# EAGLE design calculator (EAGLE 9.6.2)
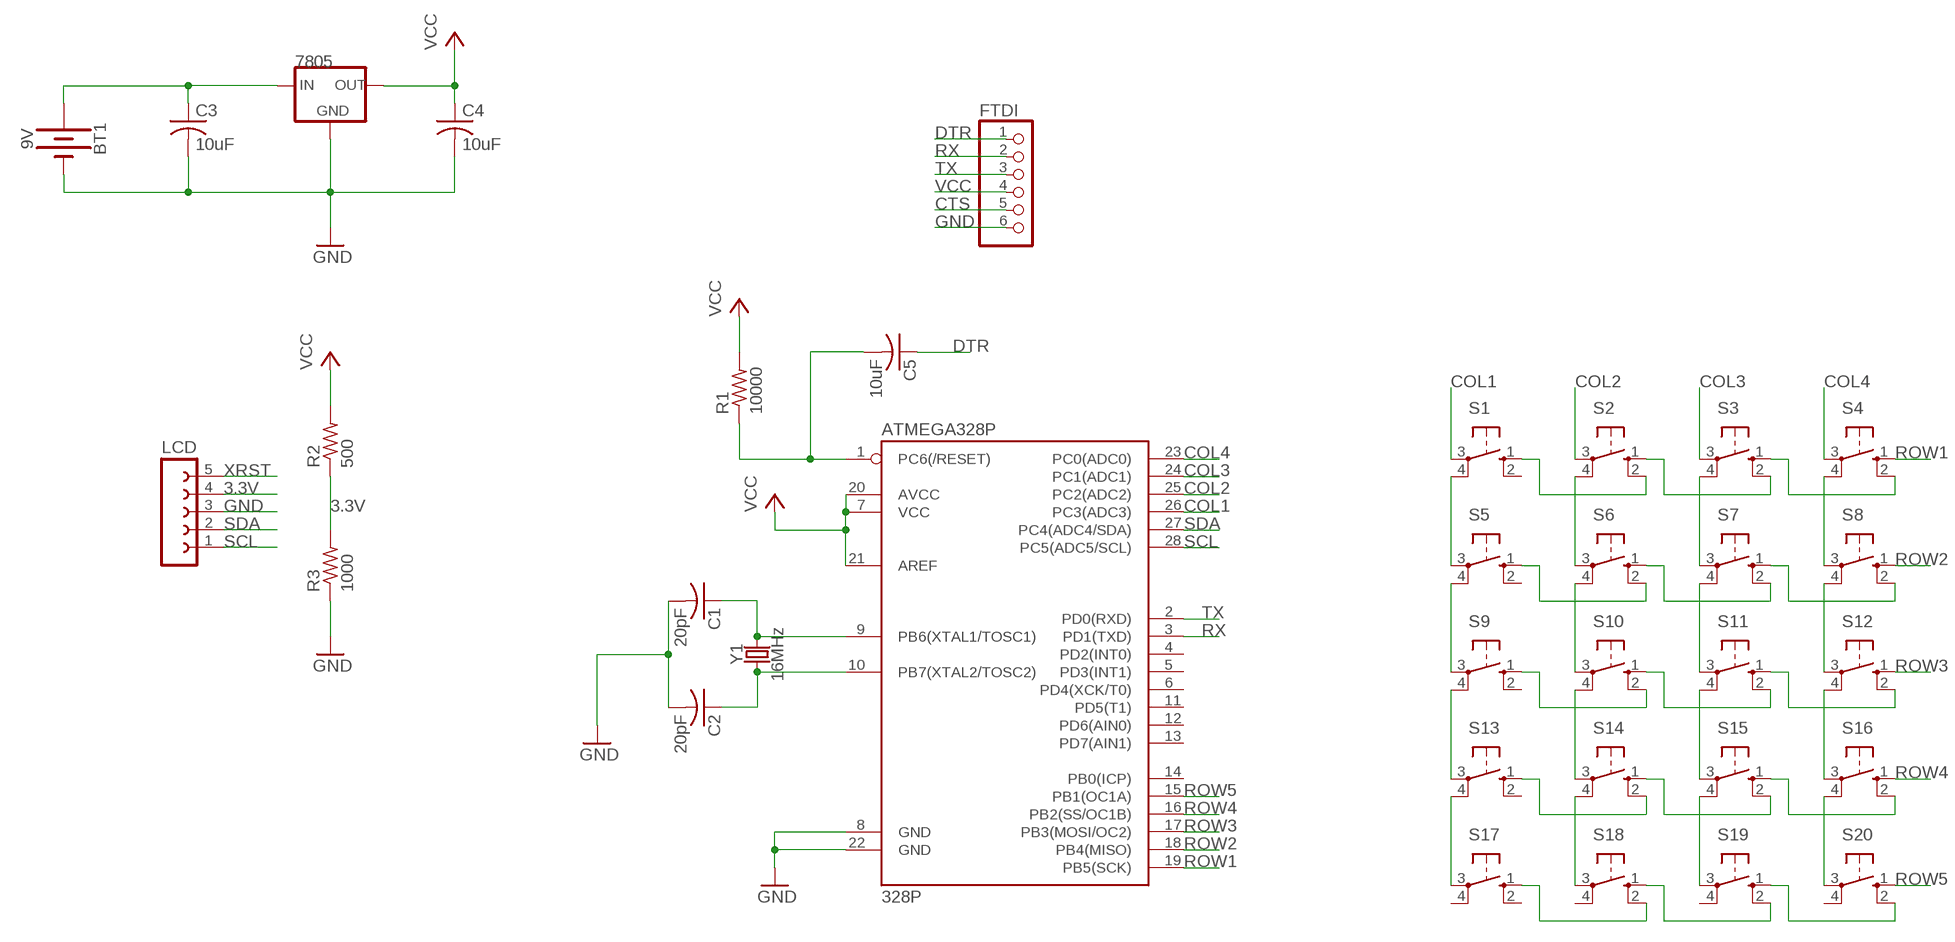
[diagram p0: schematic, sheet 1]

## Parts
7805  78XXS  [78XXS]
ATMEGA328P  328P  ATMEGA328P_PDIP  [DIP28]
BT1  9V  BATTERY-9V  [BATTCON_9V]
C1  20pF  C-US025-024X044  [C025-024X044]
C2  20pF  C-US025-024X044  [C025-024X044]
C3  10uF  C-US025-024X044  [C025-024X044]
C4  10uF  C-US025-024X044  [C025-024X044]
C5  10uF  C-US025-024X044  [C025-024X044]
FTDI  PINHD-1X6  [1X06]
LCD  FE05-1  [FE05-1]
R1  10000  R-US_0204/7  [0204/7]
R2  500  R-US_0204/7  [0204/7]
R3  1000  R-US_0204/7  [0204/7]
S1  10-XX  [B3F-10XX]
S2  10-XX  [B3F-10XX]
S3  10-XX  [B3F-10XX]
S4  10-XX  [B3F-10XX]
S5  10-XX  [B3F-10XX]
S6  10-XX  [B3F-10XX]
S7  10-XX  [B3F-10XX]
S8  10-XX  [B3F-10XX]
S9  10-XX  [B3F-10XX]
S10  10-XX  [B3F-10XX]
S11  10-XX  [B3F-10XX]
S12  10-XX  [B3F-10XX]
S13  10-XX  [B3F-10XX]
S14  10-XX  [B3F-10XX]
S15  10-XX  [B3F-10XX]
S16  10-XX  [B3F-10XX]
S17  10-XX  [B3F-10XX]
S18  10-XX  [B3F-10XX]
S19  10-XX  [B3F-10XX]
S20  10-XX  [B3F-10XX]
Y1  16MHz  CRYSTAL-16MHZPTH-HC49US  [HC49US]

## Nets
3.3V: LCD.4 R2.1 R3.2
COL1: ATMEGA328P.26(PC3(ADC3)) S1.3(P)
COL2: ATMEGA328P.25(PC2(ADC2)) S2.3(P)
COL3: ATMEGA328P.24(PC1(ADC1)) S3.3(P)
COL4: ATMEGA328P.23(PC0(ADC0)) S4.3(P)
CTS: FTDI.5
DTR: C5.1 FTDI.1
GND: 7805.GND ATMEGA328P.8(GND) ATMEGA328P.22(GND) BT1.- C1.2 C2.2 C3.2 C4.2 FTDI.6 LCD.3 R3.1
N$1: 7805.IN BT1.+ C3.1
N$2: ATMEGA328P.10(PB7(XTAL2/TOSC2)) C2.1 Y1.1
N$3: ATMEGA328P.9(PB6(XTAL1/TOSC1)) C1.1 Y1.2
N$4: ATMEGA328P.1(PC6(/RESET)) C5.2 R1.1
N$5: S1.4(P1) S5.3(P)
N$6: S5.4(P1) S9.3(P)
N$7: S9.4(P1) S13.3(P)
N$8: S13.4(P1) S17.3(P)
N$9: S1.1(S) S2.2(S1)
N$10: S2.4(P1) S6.3(P)
N$11: S6.4(P1) S10.3(P)
N$12: S10.4(P1) S14.3(P)
N$13: S14.4(P1) S18.3(P)
N$14: S3.1(S) S4.2(S1)
N$15: S3.4(P1) S7.3(P)
N$16: S7.4(P1) S11.3(P)
N$17: S11.4(P1) S15.3(P)
N$18: S15.4(P1) S19.3(P)
N$19: S9.1(S) S10.2(S1)
N$20: S4.4(P1) S8.3(P)
N$21: S8.4(P1) S12.3(P)
N$22: S12.4(P1) S16.3(P)
N$23: S16.4(P1) S20.3(P)
N$24: S13.1(S) S14.2(S1)
N$25: S17.1(S) S18.2(S1)
N$26: S2.1(S) S3.2(S1)
N$27: S5.1(S) S6.2(S1)
N$28: S6.1(S) S7.2(S1)
N$29: S7.1(S) S8.2(S1)
N$30: S10.1(S) S11.2(S1)
N$31: S11.1(S) S12.2(S1)
N$32: S14.1(S) S15.2(S1)
N$33: S15.1(S) S16.2(S1)
N$34: S18.1(S) S19.2(S1)
N$35: S19.1(S) S20.2(S1)
ROW1: ATMEGA328P.19(PB5(SCK)) S4.1(S)
ROW2: ATMEGA328P.18(PB4(MISO)) S8.1(S)
ROW3: ATMEGA328P.17(PB3(MOSI/OC2)) S12.1(S)
ROW4: ATMEGA328P.16(PB2(SS/OC1B)) S16.1(S)
ROW5: ATMEGA328P.15(PB1(OC1A)) S20.1(S)
RX: ATMEGA328P.3(PD1(TXD)) FTDI.2
SCL: ATMEGA328P.28(PC5(ADC5/SCL)) LCD.1
SDA: ATMEGA328P.27(PC4(ADC4/SDA)) LCD.2
TX: ATMEGA328P.2(PD0(RXD)) FTDI.3
VCC: 7805.OUT ATMEGA328P.7(VCC) ATMEGA328P.20(AVCC) ATMEGA328P.21(AREF) C4.1 FTDI.4 R1.2 R2.2
XRST: LCD.5
Unconnected: ATMEGA328P.4(PD2(INT0)) ATMEGA328P.5(PD3(INT1)) ATMEGA328P.6(PD4(XCK/T0)) ATMEGA328P.11(PD5(T1)) ATMEGA328P.12(PD6(AIN0)) ATMEGA328P.13(PD7(AIN1)) ATMEGA328P.14(PB0(ICP)) S1.2(S1) S5.2(S1) S9.2(S1) S13.2(S1) S17.2(S1) S17.4(P1) S18.4(P1) S19.4(P1) S20.4(P1)

## Library data of the parts
7805 = v-reg:78XXS: VOLTAGE REGULATOR
ATMEGA328P = SparkFun-IC-Microcontroller:ATMEGA328P_PDIP: Atmel 328P Through hole ATMEGA328P uC used in the Arduino 32kb flash, 1k EEPROM, 2k SRAM Datasheet <http://www.sparkfun.com/datasheets/Components/SMD/ATMega328.pdf> SparkFun Products Storefront component: AVR 28 Pin 20MHz 32K 6A/D - ATMega328P <https://www.sparkfun.com/products/9061> (COM-09061) SparkFun Simon Says - Through-Hole Soldering Kit <https://www.sparkfun.com/products/10547> (KIT-10547) SparkFun Learn to Solder - Simon Says <https://www.sparkfun.com/products/13708> (KIT-13708) SparkFun BigTime Watch Kit <https://www.sparkfun.com/products/11734> (KIT-11734) SparkFun ClockIt <https://www.sparkfun.com/products/10930> (KIT-10930) SparkFun Serial Enabled LCD Kit <https://www.sparkfun.com/products/10097> (LCD-10097) SparkFun Simon Tilts - Through Hole Soldering Kit <https://www.sparkfun.com/products/12634> (KIT-12634) SparkFun Frequency Counter Kit <https://www.sparkfun.com/products/10140> (KIT-10140) FabFM Radio Kit <https://www.sparkfun.com/products/11043> (KIT-11043) SparkFun Binary Blaster Kit <https://www.sparkfun.com/products/12037> (KIT-12037) SparkFun Metro-Gnome <https://www.sparkfun.com/products/9236> (KIT-09236) ATmega328 with Arduino Optiboot (Uno) <https://www.sparkfun.com/products/10524> (DEV-10524); PROD_ID: IC-09136
BT1 = SparkFun-Batteries:BATTERY: Battery - Single Cell A variety of battery chemistries, sizes, and footprints. Device List: 20MM_PTH - Coin Cell Battery Holder - 20mm (PTH) <https://www.sparkfun.com/products/783> 6.8MM_PTH - Coin Cell Battery Holder - 6.8MM(SMD) <https://www.digikey.com/product-detail/en/seiko-instruments/MS621FE-FL11E/728-1057-ND/1889208?WT.srch=1&gclid=CNOQ5a6LzdQCFZS2wAodXCkE0g> 12MM_SMD - Coin Cell Battery Holder - 12mm (SMD) <https://www.sparkfun.com/products/10592> 12MM_PTH - Coin Cell Battery Holder - 12mm (PTH) <https://www.sparkfun.com/products/7948> 20MM_SMD - 20mm Coin Cell Battery Holder (SMD) (2 legs) Used on the Big Time Watch Kit <https://www.sparkfun.com/products/11734> 20MM_SMD_4LEGS - Coin Cell Battery Holder - 20mm (SMD) <https://www.sparkfun.com/products/11892> 20MM_SMD_4LEGS_OVERPASTE - Coin Cell Battery Holder - 20mm (SMD) <https://www.sparkfun.com/products/11892> (Over-paste on the legs) 24.5MM_PTH - Coin Cell Battery Holder - 24.5mm (PTH) <https://www.sparkfun.com/products/8863> 9V - 9V Battery Holder - PC Mount Used on the SparkFun SparkPunk Sound Kit <https://www.sparkfun.com/products/11177> and SparkFun SparkPunk Sequencer Kit <https://www.sparkfun.com/products/12707> 18650 - Battery Holder - 18650 (PTH) <https://www.sparkfun.com/products/13113> AA - Battery Holder - 1xAA (PTH) <https://www.sparkfun.com/products/7949> AAA - Battery Holder - 1xAAA (PTH) <https://www.sparkfun.com/products/12718> AA_KIT - Battery Holder - 1xAA (PTH) <https://www.sparkfun.com/products/7949> Special kit package - pads only have exposed copper on one side of the board. AAA_KIT - Battery Holder - 1xAAA (PTH) <https://www.sparkfun.com/products/12718> Special kit package - pads only have exposed copper on one side of the board.; PROD_ID: BATT-10855
C1-C5 = rcl:C-US: CAPACITOR, American symbol; SPICEPREFIX: C
FTDI = pinhead:PINHD-1X6: PIN HEADER
LCD = con-lsta:FE05-1: FEMALE HEADER; OC_FARNELL: unknown; OC_NEWARK: unknown
R1-R3 = rcl:R-US_: RESISTOR, American symbol; SPICEPREFIX: R
S1-S20 = switch-omron:10-XX: OMRON SWITCH; MPN: B3F-1000; OC_FARNELL: 176432; OC_NEWARK: 36M3542
Y1 = SparkFun-Clocks:CRYSTAL-16MHZ: 16MHz Crystal Digikey Example <http://www.digikey.com/product-search/en?keywords=535-9122-1-ND> Frequency: 16MHz Frequency Stability: ±50ppm Frequency Tolerance: ±20ppm Load Capacitance: 18pF SparkFun Products: Pro Micro -5V/16MHz <https://www.sparkfun.com/products/12640> SparkFun Serial Enabled LCD Kit <https://www.sparkfun.com/products/10097>; PROD_ID: XTAL-08181; SF_ID: COM-00536

## Board
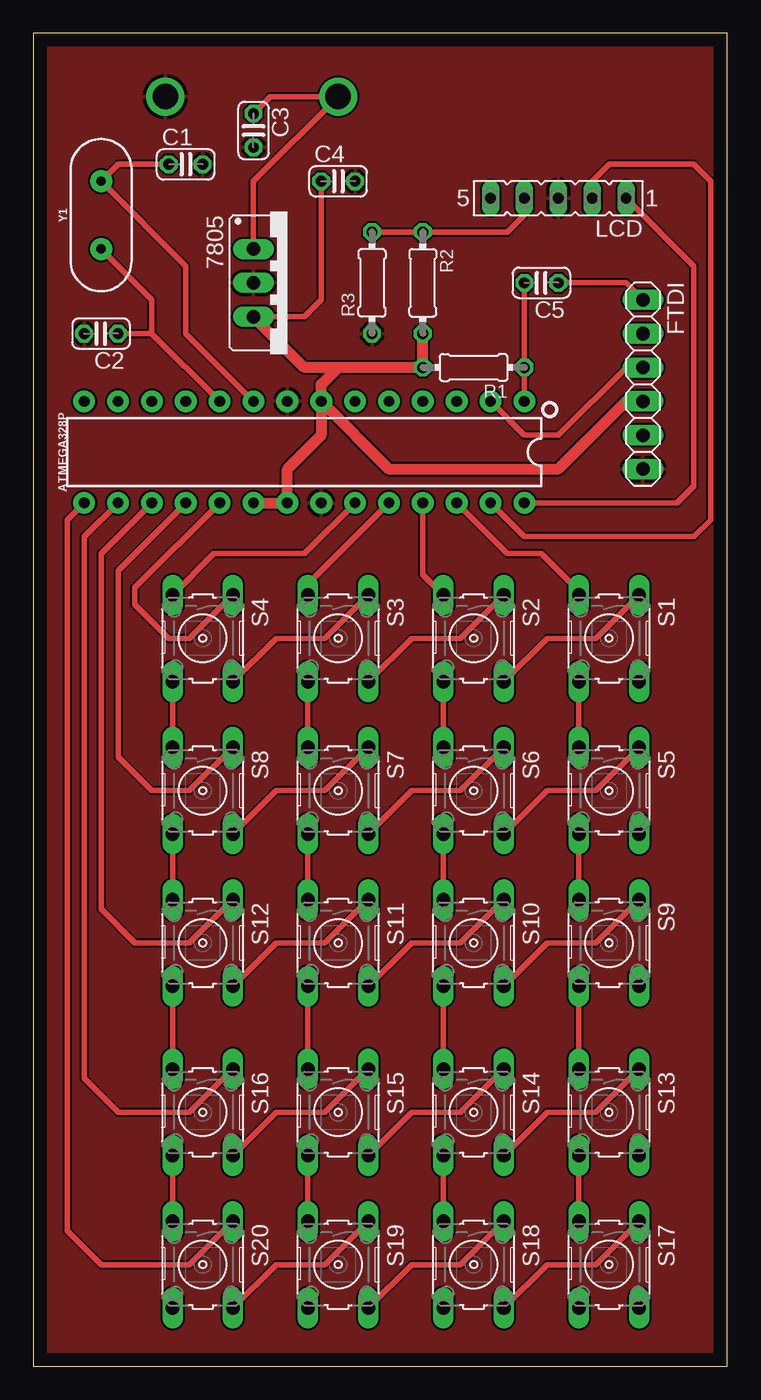
[diagram p1: board, top side]
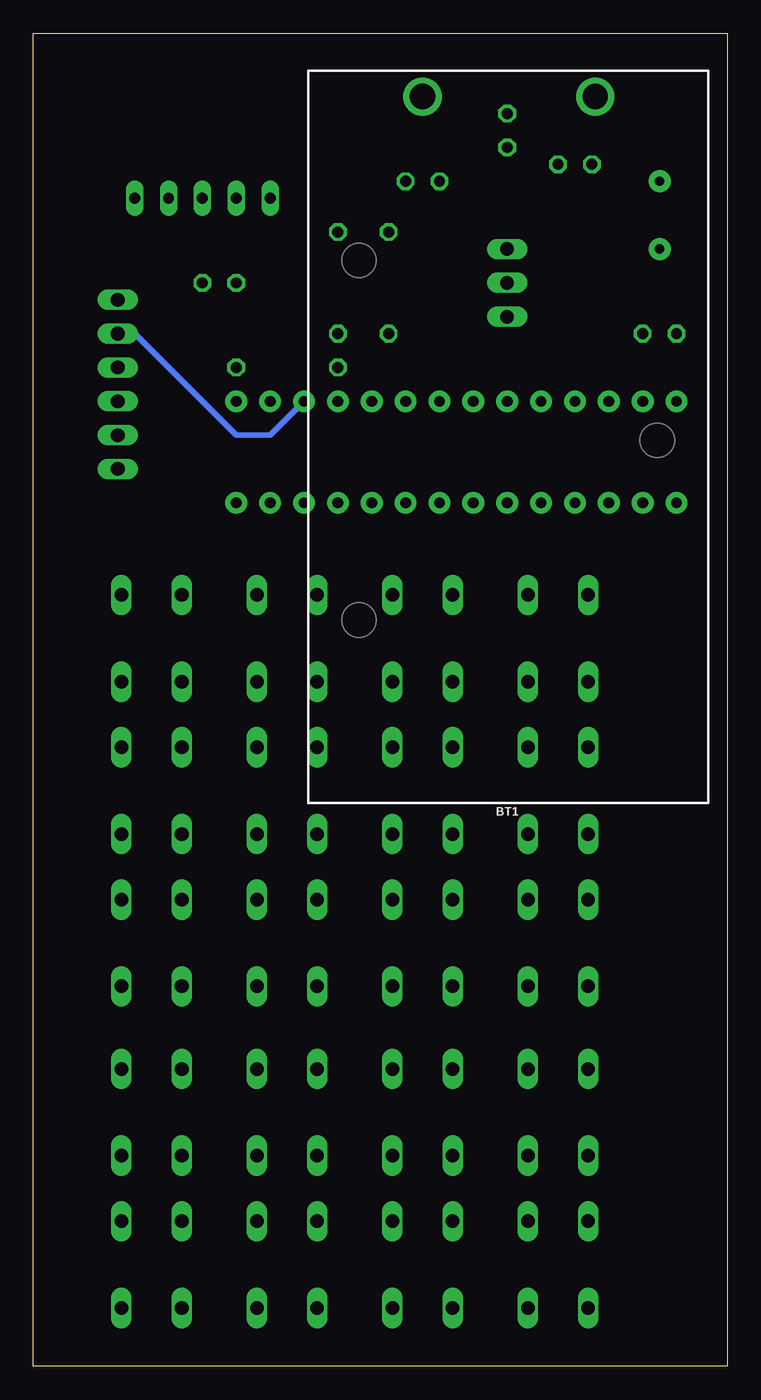
[diagram p2: board, bottom side, seen from below]

Size 52.05 x 100 mm. Coordinates in mm from the lower left corner, seen from the top.
Outline: 0,0 52.05,0 52.05,100 0,100 0,0
Copper layers (1*16): Top 0.035mm / dielectric 1.5mm / Bottom 0.035mm
Design rules "default": minimum track width 6mil, minimum drill 0.35mm, track to track 6mil, track to pad 6mil, pad to pad 6mil, via to via 6mil, smd to smd 6mil, copper to edge 40mil, drill to drill 6mil, minimum pad ring 10mil, minimum via ring 8mil, stop-mask expansion 4mil, vias tented up to drill 0mil, thermal gap 10mil

### Footprints (pad centres in the part's own frame; a part is rotated, then mirrored left to right if it is on the bottom)
78XXS = drill 1.016 long: GND 0,-2.54; IN -2.54,-2.54; OUT 2.54,-2.54
DIP28 = drill 0.813 pad 1.626: 1 -16.51,-3.81; 2 -13.97,-3.81; 3 -11.43,-3.81; 4 -8.89,-3.81; 5 -6.35,-3.81; 6 -3.81,-3.81; 7 -1.27,-3.81; 8 1.27,-3.81; 9 3.81,-3.81; 10 6.35,-3.81; 11 8.89,-3.81; 12 11.43,-3.81; 13 13.97,-3.81; 14 16.51,-3.81; 15 16.51,3.81; 16 13.97,3.81; 17 11.43,3.81; 18 8.89,3.81; 19 6.35,3.81; 20 3.81,3.81; 21 1.27,3.81; 22 -1.27,3.81; 23 -3.81,3.81; 24 -6.35,3.81; 25 -8.89,3.81; 26 -11.43,3.81; 27 -13.97,3.81; 28 -16.51,3.81
BATTCON_9V = drill 1.905: + 0,0; - 0,-12.954
C025-024X044 = drill 0.813 octagon: 1 -1.27,0; 2 1.27,0
1X06 = drill 1.016 long: 1 -6.35,0; 2 -3.81,0; 3 -1.27,0; 4 1.27,0; 5 3.81,0; 6 6.35,0
FE05-1 = drill 0.813 long: 1 -5.08,0; 2 -2.54,0; 3 0,0; 4 2.54,0; 5 5.08,0
0204/7 = drill 0.813 octagon: 1 -3.81,0; 2 3.81,0
B3F-10XX = drill 1.016 long: 1 -3.251,2.261; 2 3.251,2.261; 3 -3.251,-2.261; 4 3.251,-2.261
HC49US = drill 0.7 pad 1.651: 1 -2.54,0; 2 2.54,0

### Placement (x,y rotation side)
7805  19.05,81.28 270 top
ATMEGA328P  20.32,68.58 180 top
BT1  22.86,95.25 90 bottom
C1  11.43,90.17 0 top
C2  5.08,77.47 180 top
C3  16.51,92.71 270 top
C4  22.86,88.9 0 top
C5  38.1,81.28 180 top
FTDI  45.72,73.66 270 top
LCD  39.37,87.63 180 top
R1  33.02,74.93 180 top
R2  29.21,81.28 270 top
R3  25.4,81.28 90 top
S1  43.18,54.61 270 top
S2  33.02,54.61 270 top
S3  22.86,54.61 270 top
S4  12.7,54.61 270 top
S5  43.18,43.18 270 top
S6  33.02,43.18 270 top
S7  22.86,43.18 270 top
S8  12.7,43.18 270 top
S9  43.18,31.75 270 top
S10  33.02,31.75 270 top
S11  22.86,31.75 270 top
S12  12.7,31.75 270 top
S13  43.18,19.05 270 top
S14  33.02,19.05 270 top
S15  22.86,19.05 270 top
S16  12.7,19.05 270 top
S17  43.18,7.62 270 top
S18  33.02,7.62 270 top
S19  22.86,7.62 270 top
S20  12.7,7.62 270 top
Y1  5.08,86.36 90 top

### Tracks (layer width: path | path; a pad name or v marks a point on that pad's centre or on a via)
3.3V
  Top 0.406: R3.2 R2.1 35.56,85.09 36.83,86.36 LCD.4
COL1
  Top 0.406: ATMEGA328P.26 35.56,60.96 38.1,60.96 40.92,58.14 S1.3
COL2
  Top 0.406: ATMEGA328P.25 29.21,59.41 S2.3
COL3
  Top 0.406: ATMEGA328P.24 20.6,58.7 S3.3
COL4
  Top 0.406: S4.3 13.54,60.96 20.32,60.96 ATMEGA328P.23
DTR
  Top 0.406: FTDI.1 44.45,81.28 C5.1
GND
  pour Top: -2.54,102.87 -2.54,-2.54 162.56,-2.54 162.56,102.87
N$1
  Top 0.406: 7805.IN 16.51,88.9 BT1.+ 17.78,95.25 C3.1
N$2
  Top 0.406: 8.89,77.47 ATMEGA328P.10 | Y1.1 8.89,80.01 8.89,77.47 | C2.1 8.89,77.47
N$3
  Top 0.406: ATMEGA328P.9 11.43,77.47 11.43,82.55 Y1.2 6.35,90.17 C1.1
N$4
  Top 0.406: ATMEGA328P.1 R1.1 C5.2
N$5
  Top 0.406: S1.4 S5.3
N$6
  Top 0.406: S5.4 S9.3
N$7
  Top 0.406: S9.4 S13.3
N$8
  Top 0.406: S17.3 S13.4
N$9
  Top 0.406: S2.2 38.53,54.61 42.19,54.61 S1.1
N$10
  Top 0.406: S2.4 S6.3
N$11
  Top 0.406: S6.4 S10.3
N$12
  Top 0.406: S10.4 S14.3
N$13
  Top 0.406: S18.3 S14.4
N$14
  Top 0.406: S4.2 18.21,54.61 21.87,54.61 S3.1
N$15
  Top 0.406: S3.4 S7.3
N$16
  Top 0.406: S7.4 S11.3
N$17
  Top 0.406: S11.4 S15.3
N$18
  Top 0.406: S19.3 S15.4
N$19
  Top 0.406: S10.2 38.53,31.75 42.19,31.75 S9.1
N$20
  Top 0.406: S4.4 S8.3
N$21
  Top 0.406: S8.4 S12.3
N$22
  Top 0.406: S12.4 S16.3
N$23
  Top 0.406: S16.4 S20.3
N$24
  Top 0.406: S14.2 38.53,19.05 42.19,19.05 S13.1
N$25
  Top 0.406: S18.2 38.53,7.62 42.19,7.62 S17.1
N$26
  Top 0.406: S3.2 28.37,54.61 32.03,54.61 S2.1
N$27
  Top 0.406: S6.2 38.53,43.18 42.19,43.18 S5.1
N$28
  Top 0.406: S7.2 28.37,43.18 32.03,43.18 S6.1
N$29
  Top 0.406: S8.2 18.21,43.18 21.87,43.18 S7.1
N$30
  Top 0.406: S11.2 28.37,31.75 32.03,31.75 S10.1
N$31
  Top 0.406: S12.2 18.21,31.75 21.87,31.75 S11.1
N$32
  Top 0.406: S15.2 28.37,19.05 32.03,19.05 S14.1
N$33
  Top 0.406: S16.2 18.21,19.05 21.87,19.05 S15.1
N$34
  Top 0.406: S19.2 28.37,7.62 32.03,7.62 S18.1
N$35
  Top 0.406: S20.2 18.21,7.62 21.87,7.62 S19.1
ROW1
  Top 0.406: ATMEGA328P.19 7.62,58.42 7.62,57.15 10.16,54.61 11.71,54.61 S4.1
ROW2
  Top 0.406: ATMEGA328P.18 6.35,59.69 6.35,45.72 8.89,43.18 11.71,43.18 S8.1
ROW3
  Top 0.406: ATMEGA328P.17 5.08,60.96 5.08,34.29 7.62,31.75 11.43,31.75 11.71,31.75 S12.1
ROW4
  Top 0.406: ATMEGA328P.16 3.81,62.23 3.81,21.59 6.35,19.05 11.43,19.05 11.71,19.05 S16.1
ROW5
  Top 0.406: ATMEGA328P.15 2.54,63.5 2.54,10.16 5.08,7.62 11.43,7.62 11.71,7.62 S20.1
RX
  Bottom 0.406: FTDI.2 44.45,77.47 36.83,69.85 34.29,69.85 ATMEGA328P.3
SCL
  Top 0.406: ATMEGA328P.28 48.26,64.77 49.53,66.04 49.53,82.55 LCD.1
SDA
  Top 0.406: ATMEGA328P.27 36.83,62.23 49.53,62.23 50.8,63.5 50.8,88.9 49.53,90.17 43.18,90.17 41.91,88.9 LCD.2
TX
  Top 0.406: FTDI.3 44.45,74.93 39.37,69.85 36.83,69.85 ATMEGA328P.2
VCC
  Top 0.406: 7805.OUT 20.32,78.74 21.59,80.01 C4.1
  Top 0.813: ATMEGA328P.20 ATMEGA328P.21 19.05,67.31 21.59,69.85 ATMEGA328P.7 | ATMEGA328P.7 26.67,67.31 39.37,67.31 44.45,72.39 FTDI.4 | ATMEGA328P.7 21.59,73.66 22.86,74.93 | 22.86,74.93 R1.2 R2.2 | 22.86,74.93 20.32,74.93 7805.OUT